# Altium schematic sheet G.SchDoc
size A4
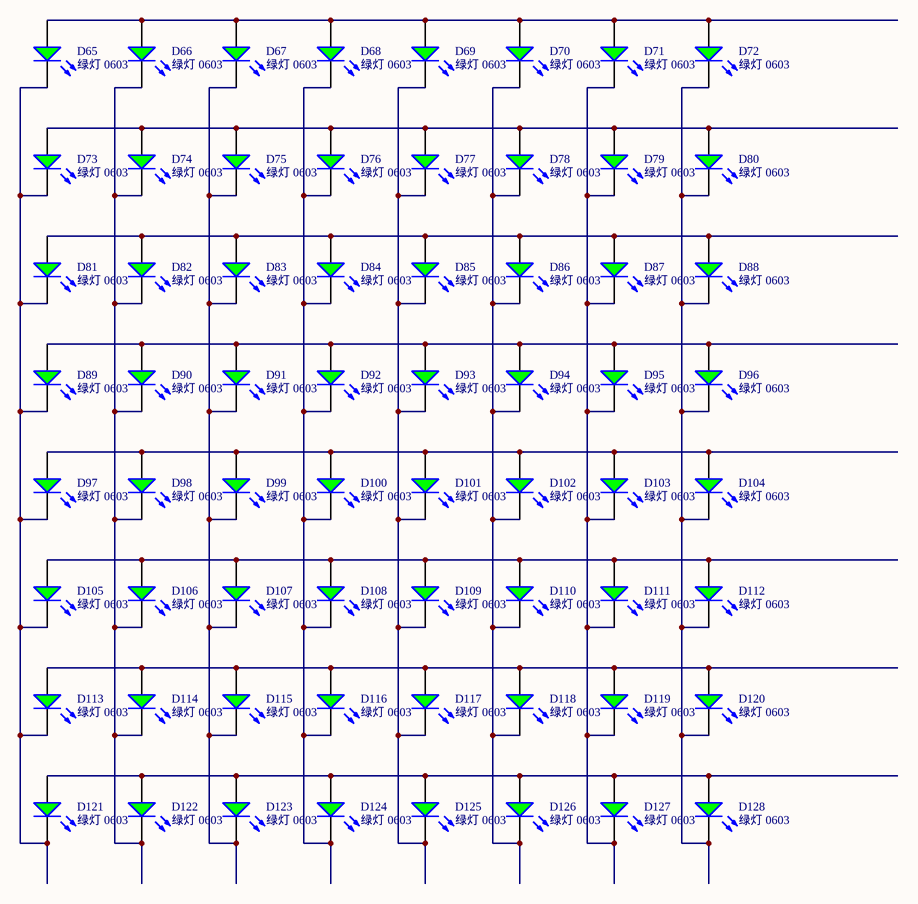
[diagram p0: G.SchDoc]

## Parts
D65  绿灯 0603  [0603_LED_S1]
D66  绿灯 0603  [0603_LED_S1]
D67  绿灯 0603  [0603_LED_S1]
D68  绿灯 0603  [0603_LED_S1]
D69  绿灯 0603  [0603_LED_S1]
D70  绿灯 0603  [0603_LED_S1]
D71  绿灯 0603  [0603_LED_S1]
D72  绿灯 0603  [0603_LED_S1]
D73  绿灯 0603  [0603_LED_S1]
D74  绿灯 0603  [0603_LED_S1]
D75  绿灯 0603  [0603_LED_S1]
D76  绿灯 0603  [0603_LED_S1]
D77  绿灯 0603  [0603_LED_S1]
D78  绿灯 0603  [0603_LED_S1]
D79  绿灯 0603  [0603_LED_S1]
D80  绿灯 0603  [0603_LED_S1]
D81  绿灯 0603  [0603_LED_S1]
D82  绿灯 0603  [0603_LED_S1]
D83  绿灯 0603  [0603_LED_S1]
D84  绿灯 0603  [0603_LED_S1]
D85  绿灯 0603  [0603_LED_S1]
D86  绿灯 0603  [0603_LED_S1]
D87  绿灯 0603  [0603_LED_S1]
D88  绿灯 0603  [0603_LED_S1]
D89  绿灯 0603  [0603_LED_S1]
D90  绿灯 0603  [0603_LED_S1]
D91  绿灯 0603  [0603_LED_S1]
D92  绿灯 0603  [0603_LED_S1]
D93  绿灯 0603  [0603_LED_S1]
D94  绿灯 0603  [0603_LED_S1]
D95  绿灯 0603  [0603_LED_S1]
D96  绿灯 0603  [0603_LED_S1]
D97  绿灯 0603  [0603_LED_S1]
D98  绿灯 0603  [0603_LED_S1]
D99  绿灯 0603  [0603_LED_S1]
D100  绿灯 0603  [0603_LED_S1]
D101  绿灯 0603  [0603_LED_S1]
D102  绿灯 0603  [0603_LED_S1]
D103  绿灯 0603  [0603_LED_S1]
D104  绿灯 0603  [0603_LED_S1]
D105  绿灯 0603  [0603_LED_S1]
D106  绿灯 0603  [0603_LED_S1]
D107  绿灯 0603  [0603_LED_S1]
D108  绿灯 0603  [0603_LED_S1]
D109  绿灯 0603  [0603_LED_S1]
D110  绿灯 0603  [0603_LED_S1]
D111  绿灯 0603  [0603_LED_S1]
D112  绿灯 0603  [0603_LED_S1]
D113  绿灯 0603  [0603_LED_S1]
D114  绿灯 0603  [0603_LED_S1]
D115  绿灯 0603  [0603_LED_S1]
D116  绿灯 0603  [0603_LED_S1]
D117  绿灯 0603  [0603_LED_S1]
D118  绿灯 0603  [0603_LED_S1]
D119  绿灯 0603  [0603_LED_S1]
D120  绿灯 0603  [0603_LED_S1]
D121  绿灯 0603  [0603_LED_S1]
D122  绿灯 0603  [0603_LED_S1]
D123  绿灯 0603  [0603_LED_S1]
D124  绿灯 0603  [0603_LED_S1]
D125  绿灯 0603  [0603_LED_S1]
D126  绿灯 0603  [0603_LED_S1]
D127  绿灯 0603  [0603_LED_S1]
D128  绿灯 0603  [0603_LED_S1]

## Nets
NetD65_A: D65.A D66.A D67.A D68.A D69.A D70.A D71.A D72.A
NetD65_K: D65.K D73.K D81.K D89.K D97.K D105.K D113.K D121.K
NetD66_K: D66.K D74.K D82.K D90.K D98.K D106.K D114.K D122.K
NetD67_K: D67.K D75.K D83.K D91.K D99.K D107.K D115.K D123.K
NetD68_K: D68.K D76.K D84.K D92.K D100.K D108.K D116.K D124.K
NetD69_K: D69.K D77.K D85.K D93.K D101.K D109.K D117.K D125.K
NetD70_K: D70.K D78.K D86.K D94.K D102.K D110.K D118.K D126.K
NetD71_K: D71.K D79.K D87.K D95.K D103.K D111.K D119.K D127.K
NetD72_K: D72.K D80.K D88.K D96.K D104.K D112.K D120.K D128.K
NetD73_A: D73.A D74.A D75.A D76.A D77.A D78.A D79.A D80.A
NetD81_A: D81.A D82.A D83.A D84.A D85.A D86.A D87.A D88.A
NetD89_A: D89.A D90.A D91.A D92.A D93.A D94.A D95.A D96.A
NetD97_A: D97.A D98.A D99.A D100.A D101.A D102.A D103.A D104.A
NetD105_A: D105.A D106.A D107.A D108.A D109.A D110.A D111.A D112.A
NetD113_A: D113.A D114.A D115.A D116.A D117.A D118.A D119.A D120.A
NetD121_A: D121.A D122.A D123.A D124.A D125.A D126.A D127.A D128.A

## Library data of the parts
D65-D128 = 0603 绿灯: 发光二极管; ComponentLink1Description: 供应商链接; ComponentLink1URL: http://www.szlcsc.com/product/details_73152.html; Package: 0603; Supplier: LC; SuppliersPartNumber: C72043